# EAGLE design EMI_filter (EAGLE 6.5.0)
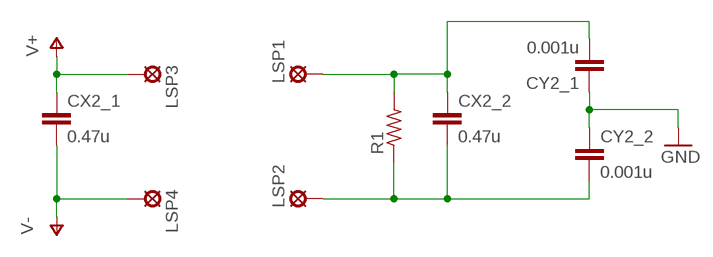
[diagram p0: schematic, sheet 1]

## Parts
CX2_1  0.47u  C-EU150-091X182  [C150-091X182]
CX2_2  0.47u  C-EU150-091X182  [C150-091X182]
CY2_1  0.001u  C-EU102-043X133  [C102-043X133]
CY2_2  0.001u  C-EU102-043X133  [C102-043X133]
LSP1  SE14  [SE14]
LSP2  SE14  [SE14]
LSP3  SE14  [SE14]
LSP4  SE14  [SE14]
R1  R-US_0617/22  [0617/22]

## Nets
GND: CY2_1.1 CY2_2.1
N$3: CX2_2.1 CY2_1.2 LSP1.MP R1.2
N$4: CX2_2.2 CY2_2.2 LSP2.MP R1.1
V+: CX2_1.1 LSP3.MP
V-: CX2_1.2 LSP4.MP

## Library data of the parts
CX2_1 CX2_2 CY2_1 CY2_2 = rcl:C-EU: CAPACITOR, European symbol
LSP1-LSP4 = solpad:SE14: SOLDER PAD E1553, drill 1,4mm, distributor Buerklin, 07F820
R1 = rcl:R-US_: RESISTOR, American symbol

## Board
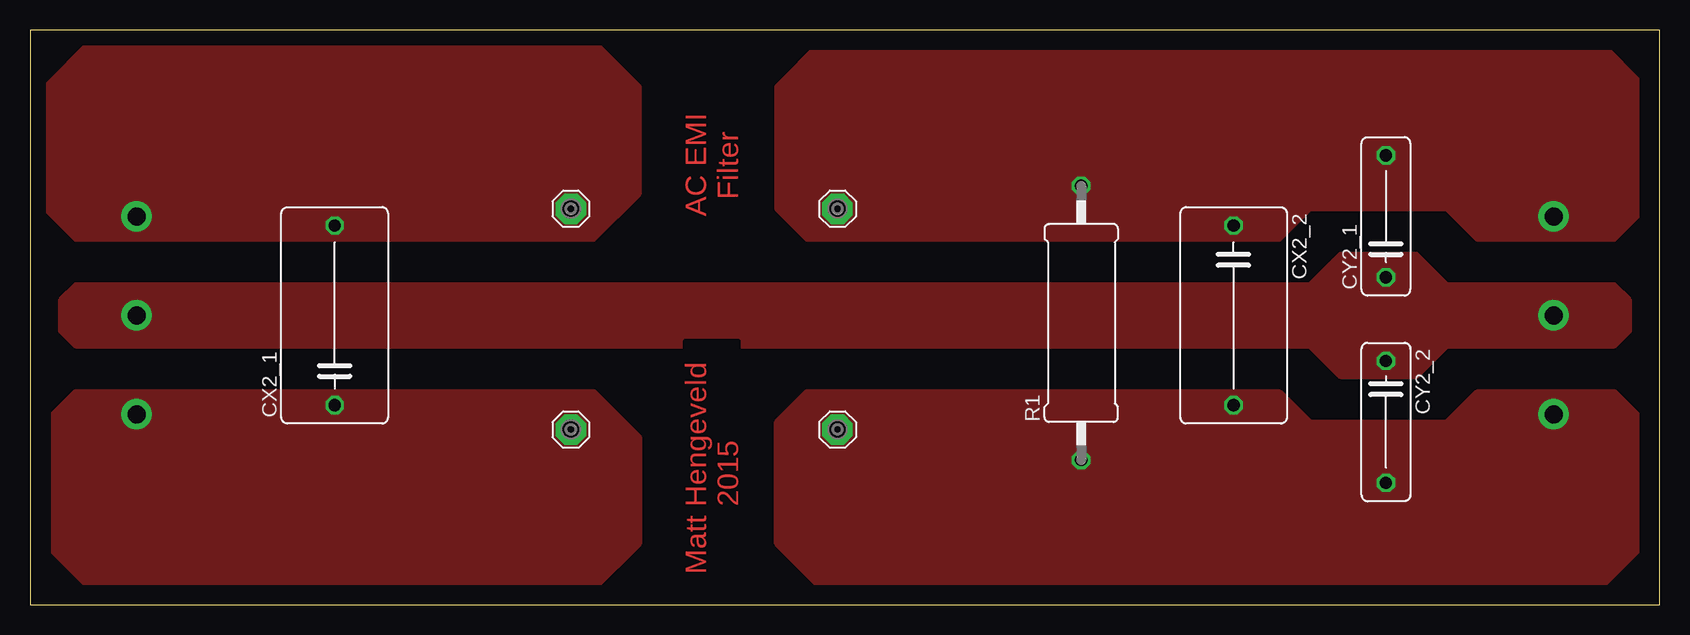
[diagram p1: board, top side]

Size 135.87 x 47.93 mm. Coordinates in mm from the lower left corner, seen from the top.
Outline: 0,0 135.87,0 135.87,47.93 0,47.93 0,0
Copper layers (1*16): Top 0.035mm / dielectric 1.5mm / Bottom 0.035mm
Design rules "default": minimum track width 10mil, minimum drill 24mil, track to track 8mil, track to pad 8mil, pad to pad 8mil, via to via 8mil, smd to smd 8mil, copper to edge 40mil, drill to drill 8mil, minimum pad ring 10mil, minimum via ring 8mil, stop-mask expansion 4mil, vias tented up to drill 0mil, thermal gap 10mil

### Footprints (pad centres in the part's own frame; a part is rotated, then mirrored left to right if it is on the bottom)
C150-091X182 = drill 1.016 octagon: 1 -7.493,0; 2 7.493,0
C102-043X133 = drill 1.016 octagon: 1 -5.08,0; 2 5.08,0
SE14 = drill 1.5 pad 2.54 octagon: MP 0,0
0617/22 = drill 1.016 octagon: 1 -11.43,0; 2 11.43,0

### Placement (x,y rotation side)
CX2_1  25.4,24.13 90 top
CX2_2  100.33,24.13 270 top
CY2_1  113.03,32.38 90 top
CY2_2  113.03,15.24 270 top
LSP1  67.31,33.02 0 top
LSP2  67.31,14.61 0 top
LSP3  45.09,14.61 0 top
LSP4  45.09,33.02 0 top
R1  87.63,23.49 90 top

### Tracks (layer width: path | path; a pad name or v marks a point on that pad's centre or on a via)
GND  (via drill 1.5 pad 2.54)
  other vias: 8.89,24.13 127,24.13
  pour Top (no thermals): 106.68,26.67 3.81,26.67 2.54,25.4 2.54,22.86 3.81,21.59 106.68,21.59 109.22,19.05 115.57,19.05 118.11,21.59 132.08,21.59 133.35,22.86 133.35,25.4 132.08,26.67 118.11,26.67 115.57,29.21 109.22,29.21
N$3  (via drill 1.5 pad 2.54)
  other vias: 127,32.38
  pour Top (isolate 1.676, no thermals): 134.62,43.18 130.81,46.99 66.04,46.99 62.23,43.18 62.23,33.02 64.77,30.48 104.14,30.48 106.68,33.02 118.11,33.02 120.65,30.48 132.08,30.48 134.62,33.02
N$4  (via drill 1.5 pad 2.54)
  other vias: 127,15.88
  pour Top (isolate 1.676, no thermals): 132.08,17.78 134.62,15.24 134.62,5.08 130.81,1.27 66.04,1.27 62.23,5.08 62.23,15.24 64.77,17.78 104.14,17.78 106.68,15.24 118.11,15.24 120.65,17.78
V+  (via drill 1.5 pad 2.54)
  other vias: 8.89,15.88
  pour Top (isolate 1.676, no thermals): 5.08,1.27 1.27,5.08 1.27,15.24 3.81,17.78 46.99,17.78 50.8,13.97 50.8,5.08 46.99,1.27
V-  (via drill 1.5 pad 2.54)
  other vias: 8.89,32.38
  pour Top (isolate 1.27, no thermals): 5.08,46.99 1.27,43.18 1.27,33.02 3.81,30.48 46.99,30.48 50.8,34.29 50.8,43.18 46.99,46.99

### Text on the board
Top: AC EMI / Filter | Matt Hengeveld / 2015